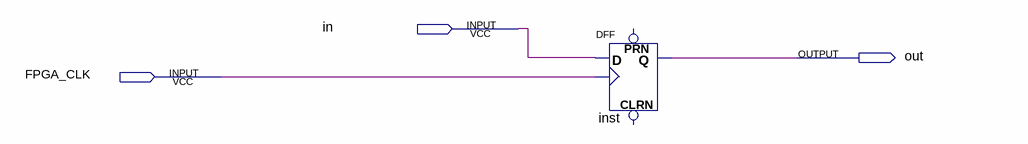
[diagram p0: schematic sheet]
// Quartus schematic buffer_1bit.bdf as structural Verilog: 1 symbols, 3 pins
module buffer_1bit (
  input  in,
  input  FPGA_CLK,
  output out
);

  DFF inst (.CLK(FPGA_CLK), .D(in), .Q(out));  // open: CLRN, PRN
endmodule
